# Altium schematic sheet MAIN.SchDoc
size A3; SheetNumber: 1; SheetTotal: 1
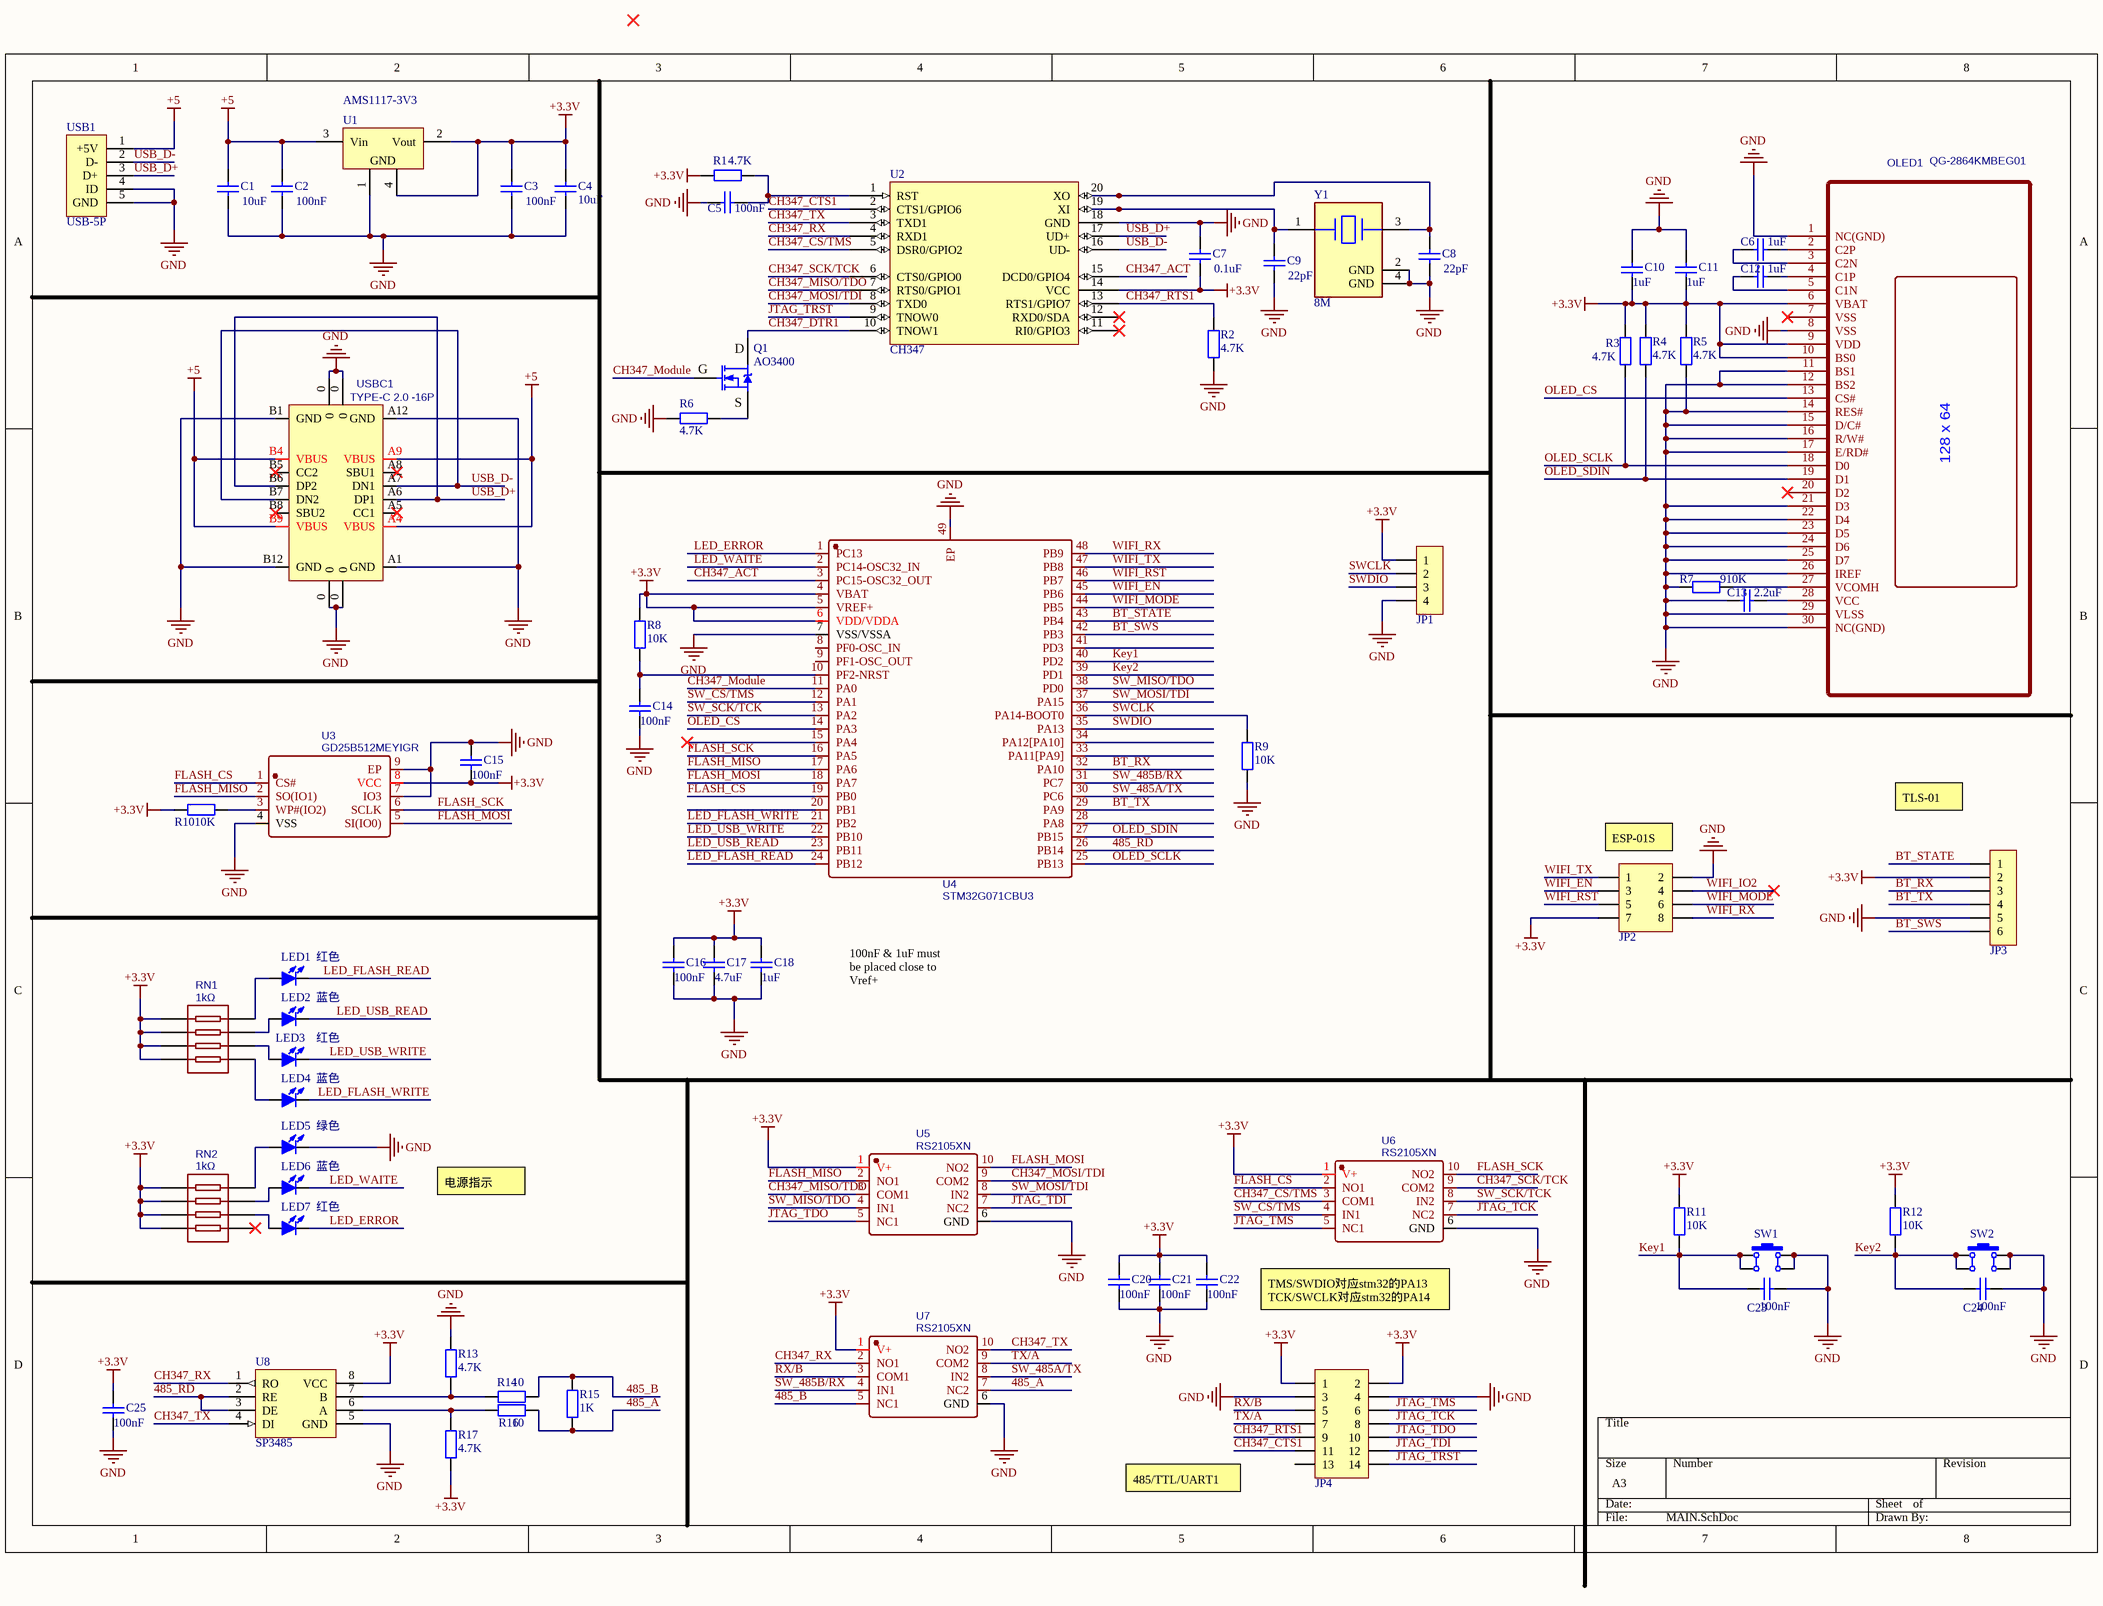
[diagram p0: MAIN.SchDoc]

## Parts
C1  10uF  [C0402_M]
C2  100nF  [C0402_M]
C3  100nF  [C0402_M]
C4  10uF  [C0402_M]
C5  100nF  [C0402_M]
C6  1uF  [C0402_M]
C7  0.1uF  [C0402_M]
C8  22pF  [C0402_M]
C9  22pF  [C0402_M]
C10  1uF  [C0402_M]
C11  1uF  [C0402_M]
C12  1uF  [C0402_M]
C13  2.2uF  [C0402_M]
C14  100nF  [C0402_M]
C15  100nF  [C0402_M]
C16  100nF  [C0402_M]
C17  4.7uF  [C0402_M]
C18  1uF  [C0402_M]
C20  100nF  [C0402_M]
C21  100nF  [C0402_M]
C22  100nF  [C0402_M]
C23  100nF  [C0402_M]
C24  100nF  [C0402_M]
C25  100nF  [C0402_M]
JP1  HDR-1X4  [HDR2.54-LI-4P]  (value not drawn)
JP2  Header 4X2  [HDR2.54-LI-2x4P]  (value not drawn)
JP3  HDR-1X6  [HDR2.54-LI-6P]  (value not drawn)
JP4  Header 2X7  [HDR2.54-WI-2x7P]  (value not drawn)
LED1  红色  [LED0603_R]
LED2  蓝色  [LED0603_R]
LED3  红色  [LED0603_R]
LED4  蓝色  [LED0603_R]
LED5  绿色  [LED0603_R]
LED6  蓝色  [LED0603_R]
LED7  红色  [LED0603_R]
OLED1  QG-2864KMBEG01  [OLED-SMD_QG-2864XXX]
Q1  AO3400  [SOT23-3L]
R1  4.7K  [R0402_M]
R2  4.7K  [R0402_M]
R3  4.7K  [R0402_M]
R4  4.7K  [R0402_M]
R5  4.7K  [R0402_M]
R6  4.7K  [R0402_M]
R7  910K  [R0402_M]
R8  10K  [R0402_M]
R9  10K  [R0402_M]
R10  10K  [R0402_M]
R11  10K  [R0402_M]
R12  10K  [R0402_M]
R13  4.7K  [R0402_M]
R14  10  [R0402_M]
R15  1K  [R0402_M]
R16  10  [R0402_M]
R17  4.7K  [R0402_M]
RN1  1kΩ  [RES-ARRAY-SMD_0402-8P-L2.0-W1.0-BL]
RN2  1kΩ  [RES-ARRAY-SMD_0402-8P-L2.0-W1.0-BL]
SW1  6x6x5  [SW SMD-6*6*6]  (value not drawn)
SW2  6x6x5  [SW SMD-6*6*6]  (value not drawn)
U1  AMS1117-3V3  [SOT223_L]
U2  CH347  [TSSOP-20]
U3  GD25B512MEYIGR  [WSON-8_L8.0-W6.0-P1.27-TL-EP-1]
U4  STM32G071CBU3  [VFQFPN48_M]
U5  RS2105XN  [MSOP10_L]
U6  RS2105XN  [MSOP10_L]
U7  RS2105XN  [MSOP10_L]
U8  SP3485  [SOP8_N]
USB1  USB-5P  [USB-MICRO_E]
USBC1  TYPE-C 2.0 -16P  [USB-C-SMD_16P]
Y1  8M  [FP-ABM11W-MFG]

## Nets
+3.3V: C3.2 C4.2 C7.1 C10.2 C11.2 C15.2 C16.1 C17.1 C18.1 C20.1 C21.1 C22.1 C25.1 JP1.1 JP2.7 JP3.2 JP4.1 JP4.2 OLED1.6(VBAT) OLED1.9(VDD) OLED1.10(BS0) R1.1 R3.1 R4.1 R5.1 R8.2 R10.2 R11.2 R12.2 R17.1 RN1.1 RN1.2 RN1.3 RN1.4 RN2.1 RN2.2 RN2.3 RN2.4 U1.2(Vout) U1.4(GND) U2.14(VCC) U3.8(VCC) U4.4(VBAT) U4.5(VREF+) U4.6(VDD/VDDA) U5.1(V+) U6.1(V+) U7.1(V+) U8.8(VCC)
+5: C1.2 C2.2 U1.3(Vin) USB1.1(+5V) USBC1.A4(VBUS) USBC1.A9(VBUS) USBC1.B4(VBUS) USBC1.B9(VBUS)
GND: C1.1 C2.1 C3.1 C4.1 C5.1 C7.2 C8.1 C9.1 C10.1 C11.1 C13.2 C14.2 C15.1 C16.2 C17.2 C18.2 C20.2 C21.2 C22.2 C23.2 C24.2 C25.2 JP1.4 JP2.2 JP3.5 JP4.3 JP4.4 LED5.2(K) OLED1.1(NC(GND)) OLED1.8(VSS) OLED1.11(BS1) OLED1.12(BS2) OLED1.14(RES#) OLED1.15(D/C#) OLED1.16(R/W#) OLED1.17(E/RD#) OLED1.21(D3) OLED1.22(D4) OLED1.23(D5) OLED1.24(D6) OLED1.25(D7) OLED1.26(IREF) OLED1.29(VLSS) OLED1.30(NC(GND)) R2.1 R5.2 R6.1 R7.1 R9.2 R13.2 SW1.2 SW1.3 SW2.2 SW2.3 U1.1(GND) U2.18(GND) U3.4(VSS) U3.7(IO3) U3.9(EP) U4.7(VSS/VSSA) U4.49(EP) U5.6(GND) U6.6(GND) U7.6(GND) U8.5(GND) USB1.4(ID) USB1.5(GND) USBC1.0 USBC1.A1(GND) USBC1.A12(GND) USBC1.B1(GND) USBC1.B12(GND) Y1.2(GND) Y1.4(GND)
485_A: R15.1 R16.1 U7.7(NC2)
485_B: R14.1 R15.2 U7.5(NC1)
485_RD: U4.26(PB14) U8.2(RE) U8.3(DE)
BT_RX: JP3.3 U4.32(PA10)
BT_STATE: JP3.1 U4.43(PB4)
BT_SWS: JP3.6 U4.42(PB3)
BT_TX: JP3.4 U4.29(PA9)
CH347_ACT: U2.15(DCD0/GPIO4) U4.3(PC15-OSC32_OUT)
CH347_~{CS}/TMS: U2.5(DSR0/GPIO2) U6.3(COM1)
CH347_CTS1: JP4.11 U2.2(CTS1/GPIO6)
CH347_DTR1: Q1.3(D) U2.10(TNOW1)
CH347_MISO/TDO: U2.7(RTS0/GPIO1) U5.3(COM1)
CH347_Module: Q1.1(G) U4.11(PA0)
CH347_MOSI/TDI: U2.8(TXD0) U5.9(COM2)
CH347_RTS1: JP4.9 R2.2 U2.13(RTS1/GPIO7)
CH347_RX: U2.4(RXD1) U7.2(NO1) U8.1(RO)
CH347_SCK/TCK: U2.6(CTS0/GPIO0) U6.9(COM2)
CH347_TX: U2.3(TXD1) U7.10(NO2) U8.4(DI)
FLASH_CS: U3.1(CS#) U4.19(PB0) U6.2(NO1)
FLASH_MISO: U3.2(SO(IO1)) U4.17(PA6) U5.2(NO1)
FLASH_MOSI: U3.5(SI(IO0)) U4.18(PA7) U5.10(NO2)
FLASH_SCK: U3.6(SCLK) U4.16(PA5) U6.10(NO2)
JTAG_TCK: JP4.8 U6.7(NC2)
JTAG_TDI: JP4.12 U5.7(NC2)
JTAG_TDO: JP4.10 U5.5(NC1)
JTAG_TMS: JP4.6 U6.5(NC1)
JTAG_TRST: JP4.14 U2.9(TNOW0)
Key1: C23.1 R11.1 SW1.1 SW1.4 U4.40(PD2)
Key2: C24.1 R12.1 SW2.1 SW2.4 U4.39(PD1)
LED_ERROR: LED7.2(K) U4.1(PC13)
LED_FLASH_READ: LED1.2(K) U4.24(PB12)
LED_FLASH_WRITE: LED4.2(K) U4.21(PB2)
LED_USB_READ: LED2.2(K) U4.23(PB11)
LED_USB_WRITE: LED3.2(K) U4.22(PB10)
LED_WAITE: LED6.2(K) U4.2(PC14-OSC32_IN)
OLED_CS: OLED1.13(CS#) U4.14(PA3)
OLED_SCLK: OLED1.18(D0) R3.2 U4.25(PB13)
OLED_SDIN: OLED1.19(D1) R4.2 U4.27(PB15)
RX/B: JP4.5 U7.3(COM1)
SW_485A/TX: U4.30(PC6) U7.8(IN2)
SW_485B/RX: U4.31(PC7) U7.4(IN1)
SW_~{CS}/TMS: U4.12(PA1) U6.4(IN1)
SW_MISO/TDO: U4.38(PD0) U5.4(IN1)
SW_MOSI/TDI: U4.37(PA15) U5.8(IN2)
SW_SCK/TCK: U4.13(PA2) U6.8(IN2)
SWCLK: JP1.2 R9.1 U4.36(PA14-BOOT0)
SWDIO: JP1.3 U4.35(PA13)
TX/A: JP4.7 U7.9(COM2)
USB_D+: U2.17(UD+) USB1.3(D+) USBC1.A6(DP1) USBC1.B6(DP2)
USB_D-: U2.16(UD-) USB1.2(D-) USBC1.A7(DN1) USBC1.B7(DN2)
WIFI_EN: JP2.3 U4.45(PB6)
WIFI_IO2: JP2.4
WIFI_MODE: JP2.6 U4.44(PB5)
WIFI_RST: JP2.5 U4.46(PB7)
WIFI_RX: JP2.8 U4.48(PB9)
WIFI_TX: JP2.1 U4.47(PB8)
NetC5_2: C5.2 R1.2 U2.1(RST)
NetC6_1: C6.1 OLED1.2(C2P)
NetC6_2: C6.2 OLED1.3(C2N)
NetC8_2: C8.2 U2.20(XO) Y1.3
NetC9_2: C9.2 U2.19(XI) Y1.1
NetC12_1: C12.1 OLED1.4(C1P)
NetC12_2: C12.2 OLED1.5(C1N)
NetC13_1: C13.1 OLED1.28(VCC)
NetC14_1: C14.1 R8.1 U4.10(PF2-NRST)
NetLED1_1: LED1.1(A) RN1.8
NetLED2_1: LED2.1(A) RN1.7
NetLED3_1: LED3.1(A) RN1.6
NetLED4_1: LED4.1(A) RN1.5
NetLED5_1: LED5.1(A) RN2.8
NetLED6_1: LED6.1(A) RN2.7
NetLED7_1: LED7.1(A) RN2.6
NetOLED1_27: OLED1.27(VCOMH) R7.2
NetQ1_2: Q1.2(S) R6.2
NetR10_1: R10.1 U3.3(WP#(IO2))
NetR13_1: R13.1 R14.2 U8.7(B)
NetR16_2: R16.2 R17.2 U8.6(A)

Not connected (* = marked no-connect by the designer): JP4 13; OLED1 7(VSS)* 20(D2)*; RN2 5*; U2 11(RI0/GPIO3)* 12(RXD0/SDA)*; U4 8(PF0-OSC_IN) 9(PF1-OSC_OUT) 15(PA4)* 20(PB1) 28(PA8) 33(PA11[PA9]) 34(PA12[PA10]) 41(PD3); USBC1 A5(CC1)* A8(SBU1)* B5(CC2)* B8(SBU2)*

## Notes on the sheet
- TLS-01
- (near JP2) ESP-01S
- 100nF & 1uF must be placed close to Vref+
- 电源指示
- TMS/SWDIO对应stm32的PA13
  TCK/SWCLK对应stm32的PA14
- 485/TTL/UART1
- (in symbol QG-2864KMBEG01) 128 x 64

## Library data of the parts
C1-C18 C20-C25 = C: 贴片电容; BOM名称: 无极性贴片电容; 联系卖家，免费查找封装: 唯一出售店铺网址https://shop463601444.taobao.com; 封装库来自淘宝卖家ID：黄晶宝石: 其他店铺购入均为盗版假冒封装库，请立即申请退款
JP1 = Header 4: 4P接插件; 封装库来自淘宝卖家 ID：黄晶宝石: 其他店铺购入均为盗版假冒封装库; 联系卖家，免费查找封装: 唯一出售店铺网址https://shop463601444.taobao.com; BOM名称: 4P接插件
JP2 = Header 4X2: 4*2P接插件; 封装库来自淘宝卖家 ID：黄晶宝石: 其他店铺购入均为盗版假冒封装库; 联系卖家，免费查找封装: 唯一出售店铺网址https://shop463601444.taobao.com; BOM名称: 4*2P接插件
JP3 = Header 6: 6P接插件; 封装库来自淘宝卖家 ID：黄晶宝石: 其他店铺购入均为盗版假冒封装库; 联系卖家，免费查找封装: 唯一出售店铺网址https://shop463601444.taobao.com; BOM名称: 6P接插件
JP4 = Header 7X2: 7*2P接插件; 封装库来自淘宝卖家 ID：黄晶宝石: 其他店铺购入均为盗版假冒封装库; 联系卖家，免费查找封装: 唯一出售店铺网址https://shop463601444.taobao.com; BOM名称: 7*2P接插件
LED1-LED7 = LED-SMD: 贴片LED; 封装库来自淘宝卖家 ID：黄晶宝石: 其他店铺购入均为假冒，请立即申请退款，本店奖励现金5~20元; BOM名称: 贴片LED
OLED1 = QG-2864KMBEG01: BOM_Manufacturer: Allvision; BOM_Supplier: LCSC; BOM_Manufacturer Part: QG-2864KMBEG01; BOM_Supplier Part: C91756; BOM_JLCPCB Part Class: Extended Part; spicePre: O; spiceSymbolName: QG-2864KMBEG01
Q1 = AO3400: N沟道 30V/4.2A; BOM名称: 场效应管; 封装库来自淘宝卖家 ID：黄晶宝石: 其他店铺购入均为盗版，不享受售后技术支持服务，请立即申请退款; 联系卖家，免费查找封装: 唯一出售店铺网址https://shop463601444.taobao.com; 参数: N沟道 30V/4.2A
R1-R17 = R: 贴片电阻; 联系卖家，免费查找封装: 唯一出售店铺网址https://shop463601444.taobao.com; 封装库来自淘宝卖家ID：黄晶宝石: 其他店铺购入均为盗版假冒封装库，请立即申请退款; BOM名称: 贴片电阻
RN1 RN2 = 1kΩ: BOM_Manufacturer: UniOhm; BOM_Manufacturer Part: 4D02WGJ0102TCE; nameAlias: Resistance; Resistance (Ohms): 1K; BOM_Supplier: LCSC; BOM_Supplier Part: C25726; BOM_JLCPCB Part Class: Extended Part; spicePre: R; spiceSymbolName: 4D02WGJ0102TCE
SW1 SW2 = TSW SMD-6x6: 贴片6x6轻触开关; 联系卖家，免费查找封装: 唯一出售店铺网址https://shop463601444.taobao.com; BOM名称: 贴片6x6轻触开关
U1 = AMS1117: 三端稳压芯片; BOM名称: 稳压芯片; 封装库来自淘宝卖家 ID：黄晶宝石: 其他店铺购入均为盗版，请立即申请退款，本店现金奖励5~20元; 联系卖家 免费查找封装: 唯一出售店铺网址https://shop463601444.taobao.com
U3 = GD25B512MEYIGR: BOM_Manufacturer: GigaDevice(兆易创新); Contributor: LCSC; BOM_Supplier: LCSC; BOM_Supplier Part: C2974186; BOM_Manufacturer Part: GD25B512MEYIGR; BOM_JLCPCB Part Class: Extended Part; spicePre: U; spiceSymbolName: GD25B512MEYIGR
U4 = STM32G071CBU3: BOM_Manufacturer: STMicroelectronics; Contributor: LCSC; BOM_Supplier: LCSC; BOM_Supplier Part: C724076; BOM_Manufacturer Part: STM32G071CBU3; BOM_JLCPCB Part Class: Extended Part; spicePre: U; spiceSymbolName: STM32G071CBU3
U5-U7 = RS2105XN: BOM_Manufacturer: RUNIC(  ); Contributor: LCSC; BOM_Supplier: LCSC; BOM_Supplier Part: C237025; BOM_Manufacturer Part: RS2105XN; BOM_JLCPCB Part Class: Extended Part; spicePre: U; spiceSymbolName: RS2105XN
U8 = SP3485: RS485总线收发芯片; 联系卖家，免费查找封装: 唯一出售店铺网址https://shop463601444.taobao.com; BOM名称: RS485总线收发芯片
USB1 = USB-5P: 微型USB母座; 联系卖家，免费技术支持: 唯一出售店铺网址https://shop463601444.taobao.com; BOM名称: 微型USB母座
USBC1 = USB2.0_Type-C_16Pin: USB2.0 Type-C 16Pin  母座; 联系卖家，免费技术支持: 唯一出售店铺网址https://shop463601444.taobao.com
Y1 = CMP-27762-001068-1: CRYSTAL 32.0000MHZ 8PF SMD; Frequency Tolerance: 10ppm; Frequency Stability: 20ppm; ESR (Equivalent Series Resistance): 80R; Frequency: 32MHz; Load Capacitance: 8pF; Packaging: Tape and Reel; Mount: Surface Mount; Min Operating Temperature: -40°C; RoHS Compliant: Yes; Max Operating Temperature: 85°C; Case/Package: SMD/SMT